# Altium schematic sheet Pair 3.SchDoc
size B
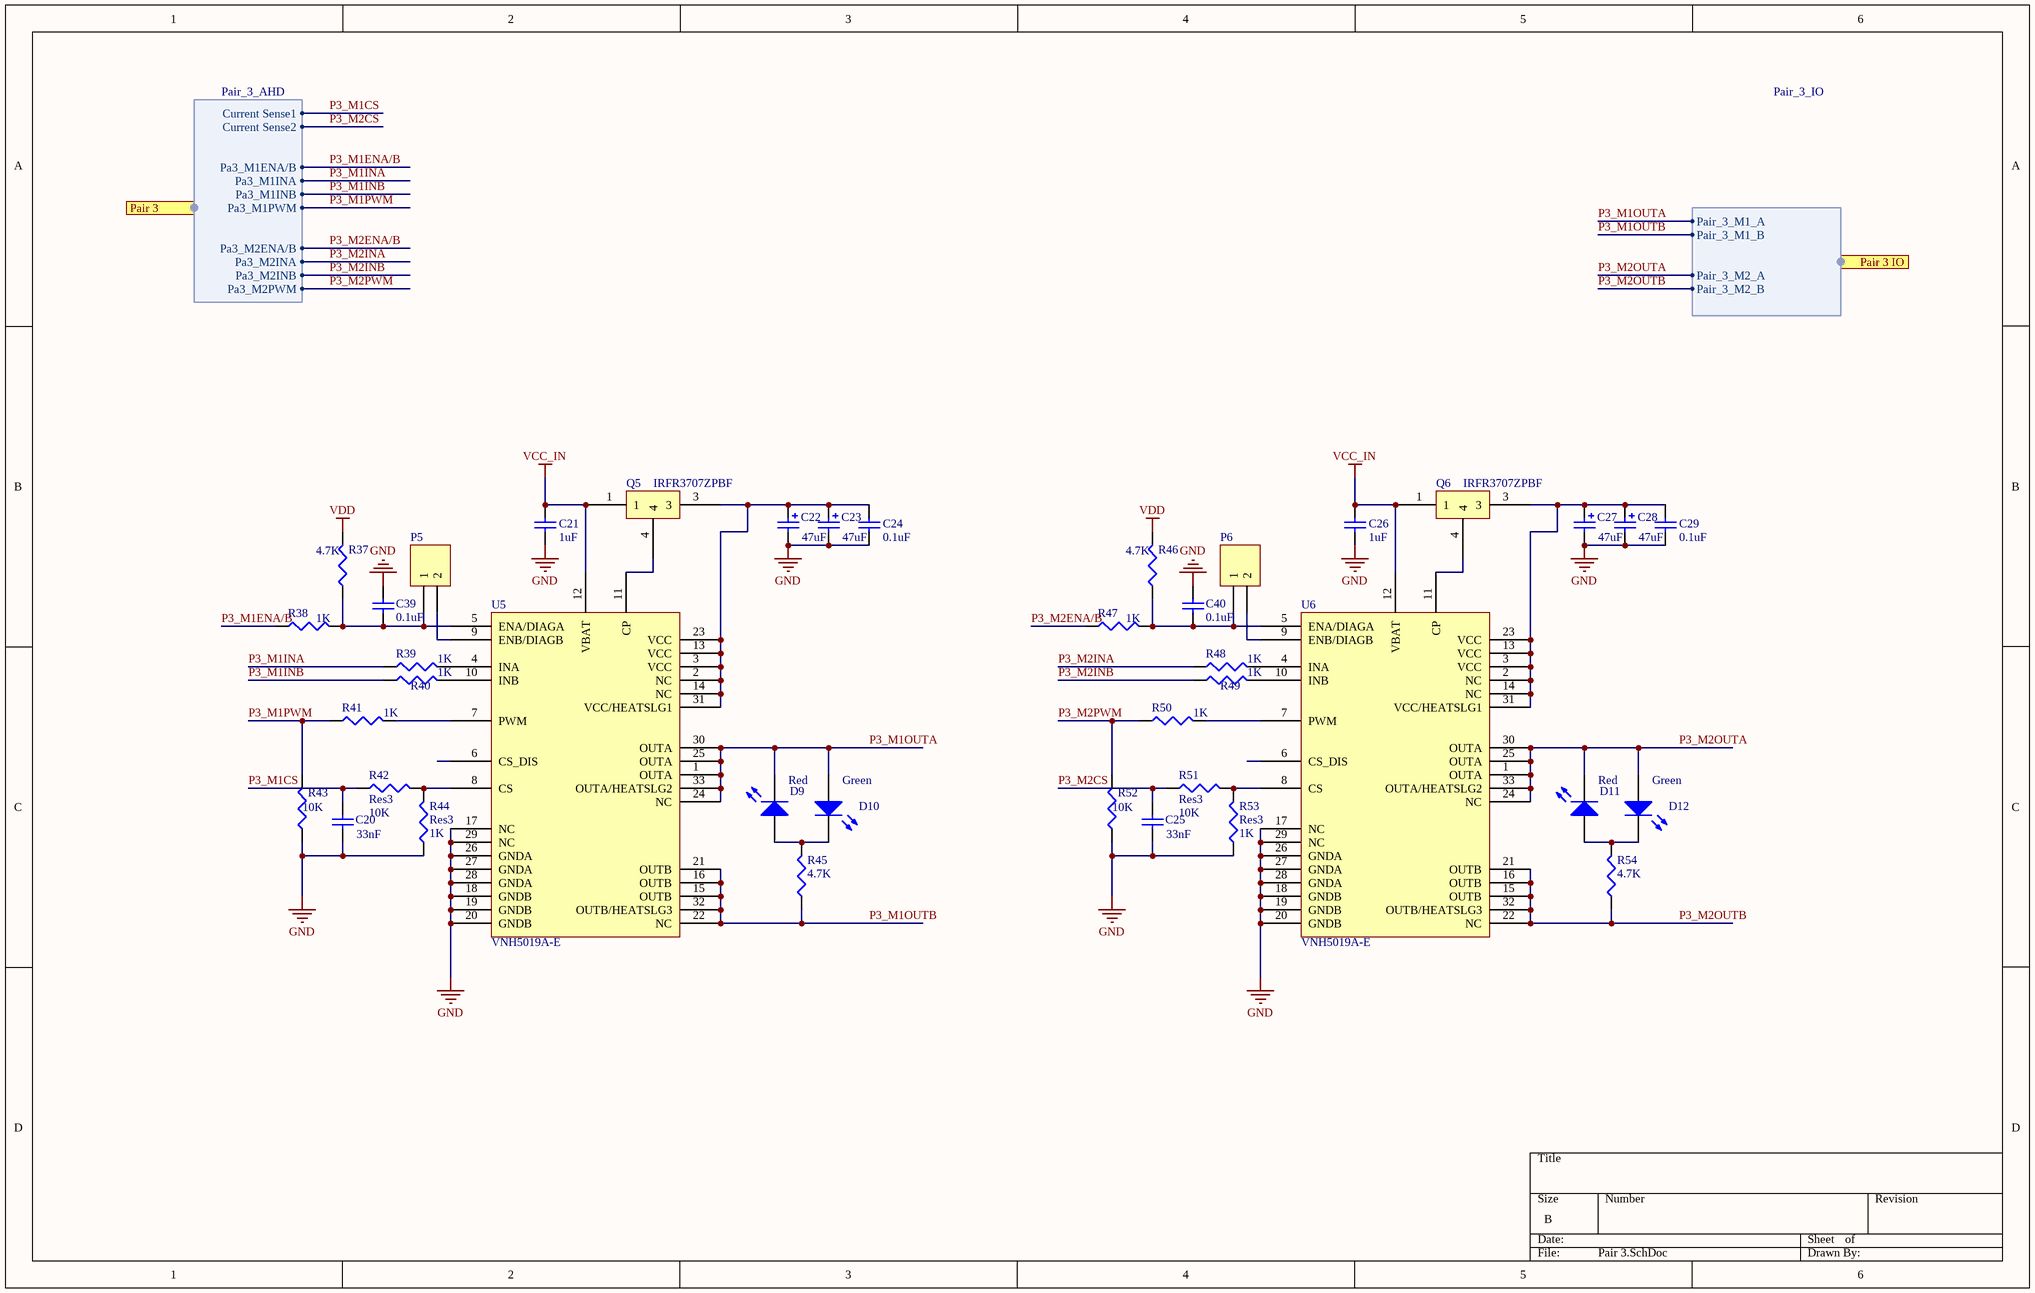
[diagram p0: Pair 3.SchDoc]

## Parts
C20  value 33nF  [1608[0603]]  (hidden comment: Cap Semi)
C21  value 1uF  [1608[0603]]  (hidden comment: Cap Semi)
C22  value 47uF  [CAPPR2-5x6.8]  (hidden comment: Cap Pol2)
C23  value 47uF  [CAPPR2-5x6.8]  (hidden comment: Cap Pol2)
C24  value 0.1uF  [C1206]  (hidden comment: Cap Semi)
C25  value 33nF  [1608[0603]]  (hidden comment: Cap Semi)
C26  value 1uF  [1608[0603]]  (hidden comment: Cap Semi)
C27  value 47uF  [CAPPR2-5x6.8]  (hidden comment: Cap Pol2)
C28  value 47uF  [CAPPR2-5x6.8]  (hidden comment: Cap Pol2)
C29  value 0.1uF  [C1206]  (hidden comment: Cap Semi)
C39  value 0.1uF  [1608[0603]]  (hidden comment: Cap Semi)
C40  value 0.1uF  [1608[0603]]  (hidden comment: Cap Semi)
D9  LED2  [3.2X1.6X1.1]  (value not drawn)
D10  LED2  [3.2X1.6X1.1]  (value not drawn)
D11  LED2  [3.2X1.6X1.1]  (value not drawn)
D12  LED2  [3.2X1.6X1.1]  (value not drawn)
P5  Header 2  [HDR1X2]  (value not drawn)
P6  Header 2  [HDR1X2]  (value not drawn)
Q5  IRFR3707ZPBF  [IRFR3707ZPBF]
Q6  IRFR3707ZPBF  [IRFR3707ZPBF]
R37  value 4.7K  [RESC1608L]  (hidden comment: Res3)
R38  value 1K  [RESC1608L]  (hidden comment: Res3)
R39  value 1K  [RESC1608L]  (hidden comment: Res3)
R40  value 1K  [RESC1608L]  (hidden comment: Res3)
R41  value 1K  [RESC1608L]  (hidden comment: Res3)
R42  Res3  value 10K  [RESC1608L]
R43  value 10K  [RESC1608L]  (hidden comment: Res3)
R44  Res3  value 1K  [RESC1608L]
R45  value 4.7K  [0805 SMD Resistor]  (hidden comment: Res3)
R46  value 4.7K  [RESC1608L]  (hidden comment: Res3)
R47  value 1K  [RESC1608L]  (hidden comment: Res3)
R48  value 1K  [RESC1608L]  (hidden comment: Res3)
R49  value 1K  [RESC1608L]  (hidden comment: Res3)
R50  value 1K  [RESC1608L]  (hidden comment: Res3)
R51  Res3  value 10K  [RESC1608L]
R52  value 10K  [RESC1608L]  (hidden comment: Res3)
R53  Res3  value 1K  [RESC1608L]
R54  value 4.7K  [0805 SMD Resistor]  (hidden comment: Res3)
U5  VNH5019A-E  [VNH5019A-E]
U6  VNH5019A-E  [VNH5019A-E]

## Ports
Pair 3 (harness Pair_3_AHD), Pair 3 IO (harness Pair_3_IO)

## Harnesses
Pair_3_IO: Pair_3_M1_A, Pair_3_M1_B, Pair_3_M2_A, Pair_3_M2_B
Pair_3_AHD: Current Sense1, Current Sense2, Pa3_M1ENA/B, Pa3_M1INA, Pa3_M1INB, Pa3_M1PWM, Pa3_M2INA, Pa3_M2ENA/B, Pa3_M2INB, Pa3_M2PWM

## Nets
GND: C20.1 C21.1 C22.2 C23.2 C24.1 C25.1 C26.1 C27.2 C28.2 C29.1 C39.1 C40.1 R43.1 R44.1 R52.1 R53.1 U5.17(NC) U5.18(GNDB) U5.19(GNDB) U5.20(GNDB) U5.26(GNDA) U5.27(GNDA) U5.28(GNDA) U5.29(NC) U6.17(NC) U6.18(GNDB) U6.19(GNDB) U6.20(GNDB) U6.26(GNDA) U6.27(GNDA) U6.28(GNDA) U6.29(NC)
VCC_IN: C21.2 C26.2 Q5.1 Q6.1 U5.12(VBAT) U6.12(VBAT)
VDD: R37.2 R46.2
P3_M1CS: C20.2 R42.1 ; port Pair 3.Current Sense1
P3_M1ENA/B: R38.1 ; port Pair 3.Pa3_M1ENA/B
P3_M1INA: R39.1 ; port Pair 3.Pa3_M1INA
P3_M1INB: R40.1 ; port Pair 3.Pa3_M1INB
P3_M1OUTA: D9.2(K) D10.1(A) U5.1(OUTA) U5.24(NC) U5.25(OUTA) U5.30(OUTA) U5.33(OUTA/HEATSLG2) ; port Pair 3 IO.Pair_3_M1_A
P3_M1OUTB: R45.1 U5.15(OUTB) U5.16(OUTB) U5.21(OUTB) U5.22(NC) U5.32(OUTB/HEATSLG3) ; port Pair 3 IO.Pair_3_M1_B
P3_M1PWM: R41.1 R43.2 ; port Pair 3.Pa3_M1PWM
P3_M2CS: C25.2 R51.1 ; port Pair 3.Current Sense2
P3_M2ENA/B: R47.1 ; port Pair 3.Pa3_M2ENA/B
P3_M2INA: R48.1 ; port Pair 3.Pa3_M2INA
P3_M2INB: R49.1 ; port Pair 3.Pa3_M2INB
P3_M2OUTA: D11.2(K) D12.1(A) U6.1(OUTA) U6.24(NC) U6.25(OUTA) U6.30(OUTA) U6.33(OUTA/HEATSLG2) ; port Pair 3 IO.Pair_3_M2_A
P3_M2OUTB: R54.1 U6.15(OUTB) U6.16(OUTB) U6.21(OUTB) U6.22(NC) U6.32(OUTB/HEATSLG3) ; port Pair 3 IO.Pair_3_M2_B
P3_M2PWM: R50.1 R52.2 ; port Pair 3.Pa3_M2PWM
NetC22_1: C22.1 C23.1 C24.2 Q5.3 U5.2(NC) U5.3(VCC) U5.13(VCC) U5.14(NC) U5.23(VCC) U5.31(VCC/HEATSLG1)
NetC27_1: C27.1 C28.1 C29.2 Q6.3 U6.2(NC) U6.3(VCC) U6.13(VCC) U6.14(NC) U6.23(VCC) U6.31(VCC/HEATSLG1)
NetC39_2: C39.2 P5.1 R37.1 R38.2 U5.5(ENA/DIAGA)
NetC40_2: C40.2 P6.1 R46.1 R47.2 U6.5(ENA/DIAGA)
NetD9_1: D9.1(A) D10.2(K) R45.2
NetD11_1: D11.1(A) D12.2(K) R54.2
NetP5_2: P5.2 U5.9(ENB/DIAGB)
NetP6_2: P6.2 U6.9(ENB/DIAGB)
NetQ5_4: Q5.4 U5.11(CP)
NetQ6_4: Q6.4 U6.11(CP)
NetR39_2: R39.2 U5.4(INA)
NetR40_2: R40.2 U5.10(INB)
NetR41_2: R41.2 U5.7(PWM)
NetR42_2: R42.2 R44.2 U5.8(CS)
NetR48_2: R48.2 U6.4(INA)
NetR49_2: R49.2 U6.10(INB)
NetR50_2: R50.2 U6.7(PWM)
NetR51_2: R51.2 R53.2 U6.8(CS)

Not connected (* = marked no-connect by the designer): U5 6(CS_DIS); U6 6(CS_DIS)

## Notes on the sheet
- Red
- (near D10) Green
- (near D12) Green

## Library data of the parts
C20 C21 C24-C26 C29 C39 C40 = Cap Semi: Capacitor (Semiconductor SIM Model); Published: 8-Jun-2000; LatestRevisionDate: 29-May-2009; LatestRevisionNote: IPC-7351 Footprint Added.; PackageReference: C1206; Publisher: Altium Limited; PackageDescription: Chip Capacitor
C22 C23 C27 C28 = Cap Pol2: Polarized Capacitor (Axial); Published: 8-Jun-2000; LatestRevisionDate: 17-Jul-2002; LatestRevisionNote: Re-released for DXP Platform.; PackageReference: POLAR0.8; Publisher: Altium Limited; PackageDescription: Polarized Capacitor; 2 Leads
D9-D12 = LED2: Typical RED, GREEN, YELLOW, AMBER GaAs LED; Published: 8-Jun-2000; LatestRevisionDate: 17-Jul-2002; LatestRevisionNote: Re-released for DXP Platform.; PackageVersion: Feb-2002; PackageReference: 3.2X1.6X1.1; Publisher: Altium Limited; PackageDescription: SM LED; 2 Flat Leads
P5 P6 = Header 2: Header, 2-Pin; LatestRevisionDate: 17-Jul-2002; LatestRevisionNote: Re-released for DXP Platform.; Publisher: Altium Limited
Q5 Q6 = IRFR3707ZPBF: Power FET
R37-R54 = Res3: Resistor; Published: 8-Jun-2000; LatestRevisionDate: 29-May-2009; LatestRevisionNote: IPC-7351 Footprint Added.; PackageReference: J1-0603; Publisher: Altium Limited; PackageDescription: Chip Resistor
U5 U6 = VNH5019A-E: VNH5019A-E H-Bridge